# Altium schematic sheet Rover_Motor_hat.SchDoc
size A; SheetNumber: 1; SheetTotal: 1
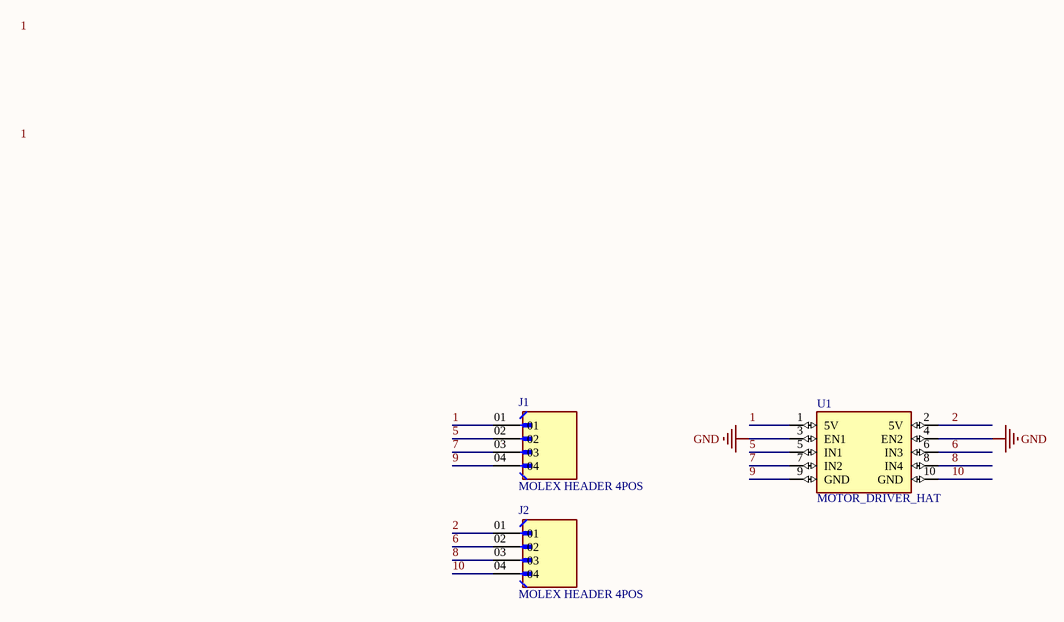
[diagram p0: Rover_Motor_hat.SchDoc]

## Parts
J1  MOLEX HEADER 4POS  [MOLEX_35362-0450]
J2  MOLEX HEADER 4POS  [MOLEX_35362-0450]
U1  MOTOR_DRIVER_HAT  [MOTOR_DRIVER_HAT]

## Nets
GND: U1.3(EN1) U1.4(EN2)
1: J1.01 U1.1(5V)
2: J2.01 U1.2(5V)
5: J1.02 U1.5(IN1)
6: J2.02 U1.6(IN3)
7: J1.03 U1.7(IN2)
8: J2.03 U1.8(IN4)
9: J1.04 U1.9(GND)
10: J2.04 U1.10(GND)

## Notes on the sheet
- Labels drawn without touching a wire or pin: 1

## Library data of the parts
J1 J2 = 35362-0450: Connector Header Through Hole 4 position 0.079 (2.00mm); SnapEDA_Link: https://www.snapeda.com/parts/35362-0450/Molex/view-part/?ref=snap; Availability: In Stock; MP: 35362-0450; Price: None; Value: *; Check_prices: https://www.snapeda.com/parts/35362-0450/Molex/view-part/?ref=eda; MF: Molex; Package: None